# Altium schematic sheet CTSensor.SchDoc: CT Sensor PWR/Interconnect
size 431 x 279 mm; DocumentNumber: 11; SheetNumber: 11; SheetTotal: 18; ENG_APP_DATE: --/--/--; DSN_APP_DATE: --/--/--; CHK_APP_DATE: --/--/--
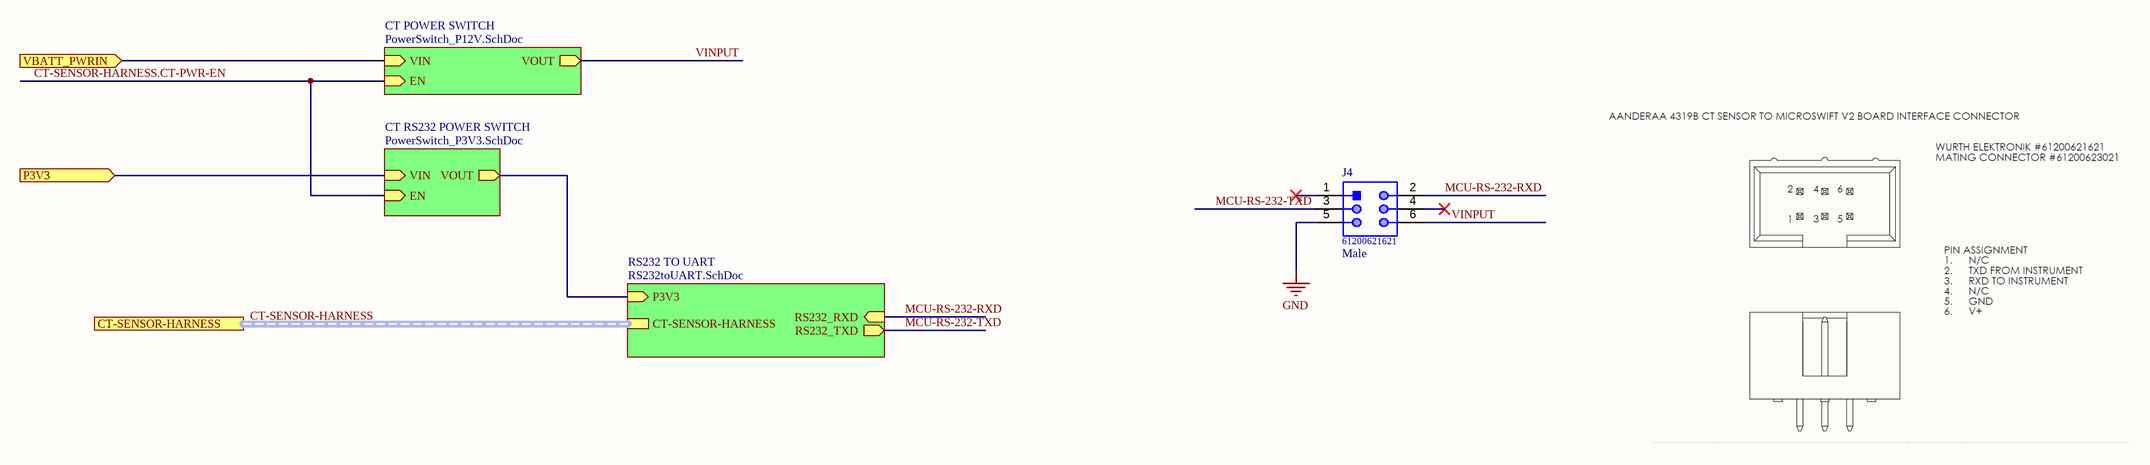
[diagram p0: CTSensor.SchDoc]

## Parts
J4  61200621621  Gender: Male  [61200621621]

## Sub-sheets
CT POWER SWITCH = PowerSwitch_P12V.SchDoc: VOUT (out), VIN (in), EN (in)
CT RS232 POWER SWITCH = PowerSwitch_P3V3.SchDoc: VOUT (out), VIN (in), EN (in)
RS232 TO UART = RS232toUART.SchDoc: RS232_RXD (in), RS232_TXD (out), CT-SENSOR-HARNESS (harness CT-SENSOR), P3V3 (in)

## Ports
CT-SENSOR-HARNESS (harness CT-SENSOR), P3V3 (in), VBATT_PWRIN (in)

## Nets
GND: J4.5
CT-SENSOR-HARNESS.CT-PWR-EN: sheet CT POWER SWITCH/EN, sheet CT RS232 POWER SWITCH/EN
MCU-RS-232-RXD: J4.2 ; sheet RS232 TO UART/RS232_RXD
MCU-RS-232-TXD: J4.3 ; sheet RS232 TO UART/RS232_TXD
P3V3: port P3V3, sheet CT RS232 POWER SWITCH/VIN
VBATT_PWRIN: port VBATT_PWRIN, sheet CT POWER SWITCH/VIN
VINPUT: J4.6 ; sheet CT POWER SWITCH/VOUT
(unnamed): sheet RS232 TO UART/P3V3, sheet CT RS232 POWER SWITCH/VOUT

Not connected (* = marked no-connect by the designer): J4 1* 4*

## Buses and harness runs
harness CT-SENSOR-HARNESS = port CT-SENSOR-HARNESS = sheet RS232 TO UART/CT-SENSOR-HARNESS

## Notes on the sheet
- THIS DOCUMENT AND THE DATA DISCLOSED HEREIN OR HEREWITH IS THE PROPERTY OF APPLIED PHYSICS LAB - UNIVERSITY OF WASHINGTON.
- PROJECT
- TITLE
- FILE NAME
- SIZE
- B
- CAGE CODE
- DWG NO.
- SHEET
- OF
- REV

## Library data of the parts
J4 = CMP-002-00121-3: Conn Shrouded Header (4 Sides) M 6 POS 2.54mm Solder ST Top Entry Thru-Hole Tray; Manufacturer: Wurth Electronics; Number of Contacts: 6; Pitch: 0.1inch; Number of Rows: 2; Series: WR-BHD; Contact Plating: Gold; Case/Package: Header; Mount: Through Hole